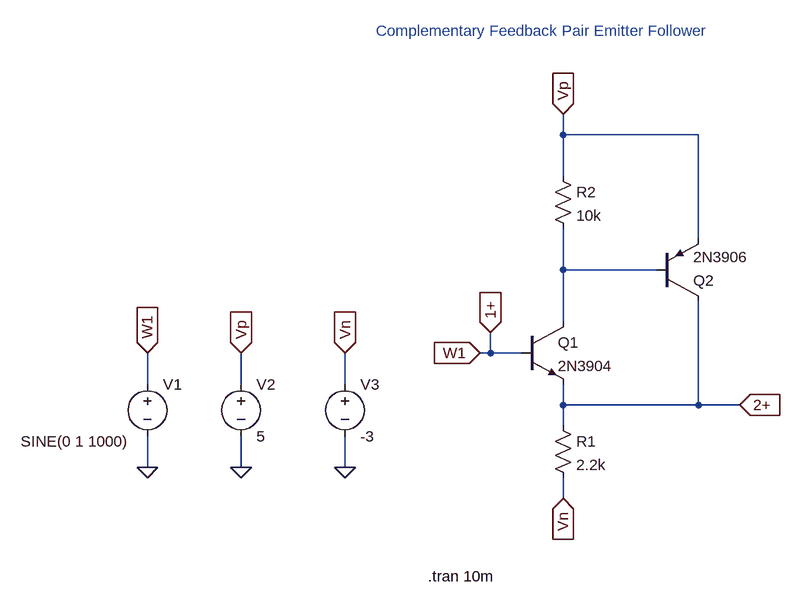
[diagram p0: schematic compl_fb_flw_ltspice.asc]
compl_fb_flw_ltspice.asc, the LTspice schematic file:
Version 4
SHEET 1 916 680
WIRE 48 -400 48 -432
WIRE 256 -400 48 -400
WIRE 48 -336 48 -400
WIRE 256 -240 256 -400
WIRE 48 -192 48 -256
WIRE 192 -192 48 -192
WIRE 48 -112 48 -192
WIRE -64 -64 -64 -96
WIRE -64 -64 -80 -64
WIRE -16 -64 -64 -64
WIRE -592 -16 -592 -64
WIRE -448 -16 -448 -64
WIRE -288 -16 -288 -64
WIRE 48 16 48 -16
WIRE 256 16 256 -144
WIRE 256 16 48 16
WIRE 320 16 256 16
WIRE 48 48 48 16
WIRE -592 112 -592 64
WIRE -448 112 -448 64
WIRE -288 112 -288 64
WIRE 48 160 48 128
FLAG -592 112 0
FLAG -448 112 0
FLAG -288 112 0
FLAG -592 -64 W1
IOPIN -592 -64 In
FLAG -448 -64 Vp
IOPIN -448 -64 In
FLAG -288 -64 Vn
IOPIN -288 -64 In
FLAG -80 -64 W1
IOPIN -80 -64 In
FLAG 320 16 2+
IOPIN 320 16 In
FLAG 48 -432 Vp
IOPIN 48 -432 In
FLAG -64 -96 1+
IOPIN -64 -96 In
FLAG 48 160 Vn
IOPIN 48 160 In
SYMBOL voltage -592 -32 R0
WINDOW 3 -195 104 Left 2
WINDOW 123 0 0 Left 0
WINDOW 39 0 0 Left 0
SYMATTR Value SINE(0 1 1000)
SYMATTR InstName V1
SYMBOL voltage -448 -32 R0
WINDOW 123 0 0 Left 0
WINDOW 39 0 0 Left 0
SYMATTR InstName V2
SYMATTR Value 5
SYMBOL voltage -288 -32 R0
WINDOW 123 0 0 Left 0
WINDOW 39 0 0 Left 0
SYMATTR InstName V3
SYMATTR Value -3
SYMBOL npn -16 -112 R0
SYMATTR InstName Q1
SYMATTR Value 2N3904
SYMBOL pnp 192 -144 M180
SYMATTR InstName Q2
SYMATTR Value 2N3906
SYMBOL res 32 32 R0
SYMATTR InstName R1
SYMATTR Value 2.2k
SYMBOL res 32 -352 R0
SYMATTR InstName R2
SYMATTR Value 10k
TEXT -160 280 Left 2 !.tran 10m
TEXT -240 -560 Left 2 ;Complementary Feedback Pair Emitter Follower

The netlist it stands for:
* compl_fb_flw_ltspice.asc
V1 1+ 0 SINE(0 1 1000)
V2 Vp 0 5
V3 Vn 0 -3
Q1 N001 1+ 2+ 0 2N3904
Q2 2+ N001 Vp 0 2N3906
R1 2+ Vn 2.2k
R2 Vp N001 10k
.model NPN NPN
.model PNP PNP
.lib standard.bjt
.tran 10m
* Complementary Feedback Pair Emitter Follower
.backanno
.end